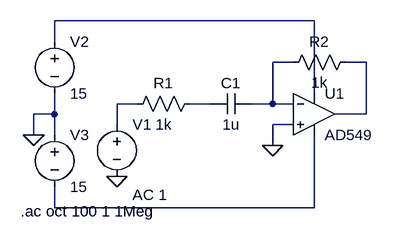
[diagram p0: schematic HighPassFilter1.asc]
HighPassFilter1.asc, the LTspice schematic file:
Version 4
SHEET 1 880 680
WIRE 160 0 -240 0
WIRE -240 32 -240 0
WIRE 128 64 96 64
WIRE 240 64 208 64
WIRE 160 112 160 0
WIRE -112 128 -144 128
WIRE 0 128 -32 128
WIRE 96 128 96 64
WIRE 96 128 64 128
WIRE 128 128 96 128
WIRE -240 144 -240 112
WIRE -240 144 -272 144
WIRE 240 144 240 64
WIRE 240 144 192 144
WIRE -144 160 -144 128
WIRE 128 160 96 160
WIRE -272 176 -272 144
WIRE -240 176 -240 144
WIRE 96 192 96 160
WIRE -240 288 -240 256
WIRE 160 288 160 176
WIRE 160 288 -240 288
FLAG -272 176 0
FLAG -144 240 0
FLAG 96 192 0
SYMBOL Opamps\\AD549 160 80 R0
SYMATTR InstName U1
SYMBOL res -16 112 R90
WINDOW 0 0 56 VBottom 2
WINDOW 3 32 56 VTop 2
SYMATTR InstName R1
SYMATTR Value 1k
SYMBOL res 224 48 R90
WINDOW 0 0 56 VBottom 2
WINDOW 3 32 56 VTop 2
SYMATTR InstName R2
SYMATTR Value 1k
SYMBOL cap 64 112 R90
WINDOW 0 0 32 VBottom 2
WINDOW 3 32 32 VTop 2
SYMATTR InstName C1
SYMATTR Value 1u
SYMBOL voltage -144 144 R0
WINDOW 123 24 124 Left 2
WINDOW 39 0 0 Left 0
SYMATTR InstName V1
SYMATTR Value ""
SYMATTR Value2 AC 1
SYMBOL voltage -240 16 R0
WINDOW 123 0 0 Left 0
WINDOW 39 0 0 Left 0
SYMATTR InstName V2
SYMATTR Value 15
SYMBOL voltage -240 160 R0
WINDOW 123 0 0 Left 0
WINDOW 39 0 0 Left 0
SYMATTR InstName V3
SYMATTR Value 15
TEXT -292 294 Left 2 !.ac oct 100 1 1Meg

The netlist it stands for:
* HighPassFilter1.asc
XU1 0 N002 N001 N006 N003 AD549  ; pins In+ In- V+ V- OUT
R1 N005 N004 1k
R2 N003 N002 1k
C1 N002 N005 1u
V1 N004 0 AC 1
V2 N001 0 15
V3 0 N006 15
.ac oct 100 1 1Meg
.backanno
.end